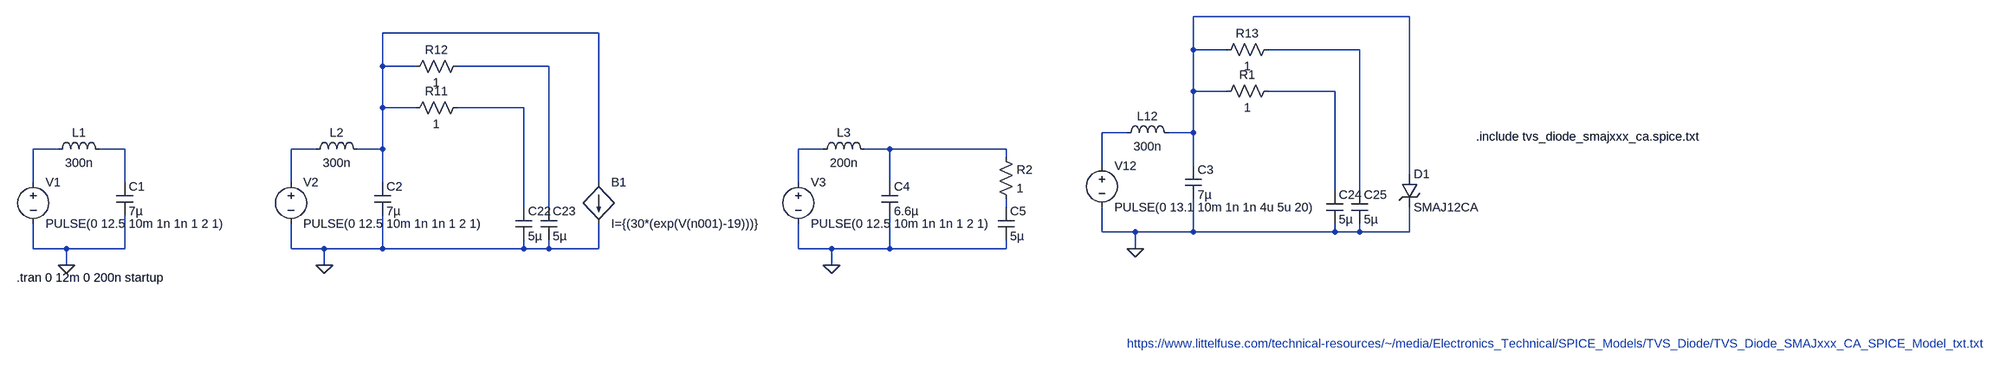
[diagram p0: schematic Inrush.asc]
Inrush.asc, the LTspice schematic file:
Version 4
SHEET 1 4520 1060
WIRE 2896 -192 2480 -192
WIRE 1104 -160 688 -160
WIRE 2480 -128 2480 -192
WIRE 2544 -128 2480 -128
WIRE 2800 -128 2624 -128
WIRE 688 -96 688 -160
WIRE 752 -96 688 -96
WIRE 1008 -96 832 -96
WIRE 2480 -48 2480 -128
WIRE 2544 -48 2480 -48
WIRE 2752 -48 2624 -48
WIRE 688 -16 688 -96
WIRE 752 -16 688 -16
WIRE 960 -16 832 -16
WIRE 2352 32 2304 32
WIRE 2480 32 2480 -48
WIRE 2480 32 2432 32
WIRE 64 64 16 64
WIRE 192 64 144 64
WIRE 560 64 512 64
WIRE 688 64 688 -16
WIRE 688 64 640 64
WIRE 1536 64 1488 64
WIRE 1664 64 1616 64
WIRE 1888 64 1664 64
WIRE 1888 80 1888 64
WIRE 2304 96 2304 32
WIRE 2480 96 2480 32
WIRE 2896 112 2896 -192
WIRE 16 128 16 64
WIRE 192 128 192 64
WIRE 512 128 512 64
WIRE 688 128 688 64
WIRE 1104 128 1104 -160
WIRE 1488 128 1488 64
WIRE 1664 128 1664 64
WIRE 2752 144 2752 -48
WIRE 2800 144 2800 -128
WIRE 960 176 960 -16
WIRE 1008 176 1008 -96
WIRE 1888 176 1888 160
WIRE 2304 224 2304 176
WIRE 2368 224 2304 224
WIRE 2480 224 2480 160
WIRE 2480 224 2368 224
WIRE 2752 224 2752 208
WIRE 2752 224 2480 224
WIRE 2800 224 2800 208
WIRE 2800 224 2752 224
WIRE 2896 224 2896 176
WIRE 2896 224 2800 224
WIRE 16 256 16 208
WIRE 80 256 16 256
WIRE 192 256 192 192
WIRE 192 256 80 256
WIRE 512 256 512 208
WIRE 576 256 512 256
WIRE 688 256 688 192
WIRE 688 256 576 256
WIRE 960 256 960 240
WIRE 960 256 688 256
WIRE 1008 256 1008 240
WIRE 1008 256 960 256
WIRE 1104 256 1104 208
WIRE 1104 256 1008 256
WIRE 1488 256 1488 208
WIRE 1552 256 1488 256
WIRE 1664 256 1664 192
WIRE 1664 256 1552 256
WIRE 1888 256 1888 240
WIRE 1888 256 1664 256
WIRE 2368 256 2368 224
WIRE 80 288 80 256
WIRE 576 288 576 256
WIRE 1552 288 1552 256
FLAG 80 288 0
FLAG 576 288 0
FLAG 1552 288 0
FLAG 2368 256 0
SYMBOL voltage 16 112 R0
WINDOW 123 0 0 Left 0
WINDOW 39 0 0 Left 0
SYMATTR InstName V1
SYMATTR Value PULSE(0 12.5 10m 1n 1n 1 2 1)
SYMBOL cap 176 128 R0
SYMATTR InstName C1
SYMATTR Value 7µ
SYMATTR SpiceLine Rser=0.005
SYMBOL ind 48 80 R270
WINDOW 0 32 56 VTop 2
WINDOW 3 5 56 VBottom 2
SYMATTR InstName L1
SYMATTR Value 300n
SYMATTR SpiceLine Rser=0.005
SYMBOL voltage 512 112 R0
WINDOW 123 0 0 Left 0
WINDOW 39 0 0 Left 0
SYMATTR InstName V2
SYMATTR Value PULSE(0 12.5 10m 1n 1n 1 2 1)
SYMBOL cap 672 128 R0
SYMATTR InstName C2
SYMATTR Value 7µ
SYMATTR SpiceLine Rser=0.005
SYMBOL ind 544 80 R270
WINDOW 0 32 56 VTop 2
WINDOW 3 5 56 VBottom 2
SYMATTR InstName L2
SYMATTR Value 300n
SYMATTR SpiceLine Rser=0.005
SYMBOL voltage 1488 112 R0
WINDOW 123 0 0 Left 0
WINDOW 39 0 0 Left 0
SYMATTR InstName V3
SYMATTR Value PULSE(0 12.5 10m 1n 1n 1 2 1)
SYMBOL cap 1648 128 R0
SYMATTR InstName C4
SYMATTR Value 6.6µ
SYMATTR SpiceLine Rser=0.005
SYMBOL ind 1520 80 R270
WINDOW 0 32 56 VTop 2
WINDOW 3 5 56 VBottom 2
SYMATTR InstName L3
SYMATTR Value 200n
SYMATTR SpiceLine Rser=0.005
SYMBOL cap 1872 176 R0
SYMATTR InstName C5
SYMATTR Value 5µ
SYMBOL res 1872 64 R0
SYMATTR InstName R2
SYMATTR Value 1
SYMBOL res 848 -32 R90
WINDOW 0 0 56 VBottom 2
WINDOW 3 32 56 VTop 2
SYMATTR InstName R11
SYMATTR Value 1
SYMBOL res 848 -112 R90
WINDOW 0 0 56 VBottom 2
WINDOW 3 32 56 VTop 2
SYMATTR InstName R12
SYMATTR Value 1
SYMBOL cap 944 176 R0
SYMATTR InstName C22
SYMATTR Value 5µ
SYMBOL cap 992 176 R0
SYMATTR InstName C23
SYMATTR Value 5µ
SYMBOL bi 1104 128 R0
SYMATTR InstName B1
SYMATTR Value I={(30*(exp(V(n001)-19)))}
SYMBOL voltage 2304 80 R0
WINDOW 123 0 0 Left 0
WINDOW 39 0 0 Left 0
SYMATTR InstName V12
SYMATTR Value PULSE(0 13.1 10m 1n 1n 4u 5u 20)
SYMBOL cap 2464 96 R0
SYMATTR InstName C3
SYMATTR Value 7µ
SYMATTR SpiceLine Rser=0.001
SYMBOL ind 2336 48 R270
WINDOW 0 32 56 VTop 2
WINDOW 3 5 56 VBottom 2
SYMATTR InstName L12
SYMATTR Value 300n
SYMATTR SpiceLine Rser=0.001
SYMBOL res 2640 -64 R90
WINDOW 0 0 56 VBottom 2
WINDOW 3 32 56 VTop 2
SYMATTR InstName R1
SYMATTR Value 1
SYMBOL res 2640 -144 R90
WINDOW 0 0 56 VBottom 2
WINDOW 3 32 56 VTop 2
SYMATTR InstName R13
SYMATTR Value 1
SYMBOL cap 2736 144 R0
SYMATTR InstName C24
SYMATTR Value 5µ
SYMBOL cap 2784 144 R0
SYMATTR InstName C25
SYMATTR Value 5µ
SYMBOL TVSdiode 2880 112 R0
SYMATTR InstName D1
SYMATTR Value SMAJ12CA
SYMATTR Prefix X
TEXT -16 312 Left 2 !.tran 0 12m 0 200n startup
TEXT 3024 40 Left 2 !.include tvs_diode_smajxxx_ca.spice.txt
TEXT 2352 576 Left 2 ;https://www.littelfuse.com/technical-resources/~/media/Electronics_Technical/SPICE_Models/TVS_Diode/TVS_Diode_SMAJxxx_CA_SPICE_Model_txt.txt

The netlist it stands for:
* Inrush.asc
V1 N008 0 PULSE(0 12.5 10m 1n 1n 1 2 1)
C1 N009 0 7µ Rser=0.005
L1 N008 N009 300n Rser=0.005
V2 N010 0 PULSE(0 12.5 10m 1n 1n 1 2 1)
C2 N002 0 7µ Rser=0.005
L2 N010 N002 300n Rser=0.005
V3 N011 0 PULSE(0 12.5 10m 1n 1n 1 2 1)
C4 N012 0 6.6µ Rser=0.005
L3 N011 N012 200n Rser=0.005
C5 N013 0 5µ
R2 N012 N013 1
R11 N006 N002 1
R12 N004 N002 1
C22 N006 0 5µ
C23 N004 0 5µ
B1 N002 0 I={(30*(exp(V(n001)-19)))}
V12 N007 0 PULSE(0 13.1 10m 1n 1n 4u 5u 20)
C3 N001 0 7µ Rser=0.001
L12 N007 N001 300n Rser=0.001
R1 N005 N001 1
R13 N003 N001 1
C24 N005 0 5µ
C25 N003 0 5µ
XD1 N001 0 SMAJ12CA  ; pins + -
.tran 0 12m 0 200n startup
.include tvs_diode_smajxxx_ca.spice.txt
* https://www.littelfuse.com/technical-resources/~/media/Electronics_Technical/SPICE_Models/TVS_Diode/TVS_Diode_SMAJxxx_CA_SPICE_Model_txt.txt
.backanno
.end